# EAGLE design nxtcam_5 (EAGLE 6.4)
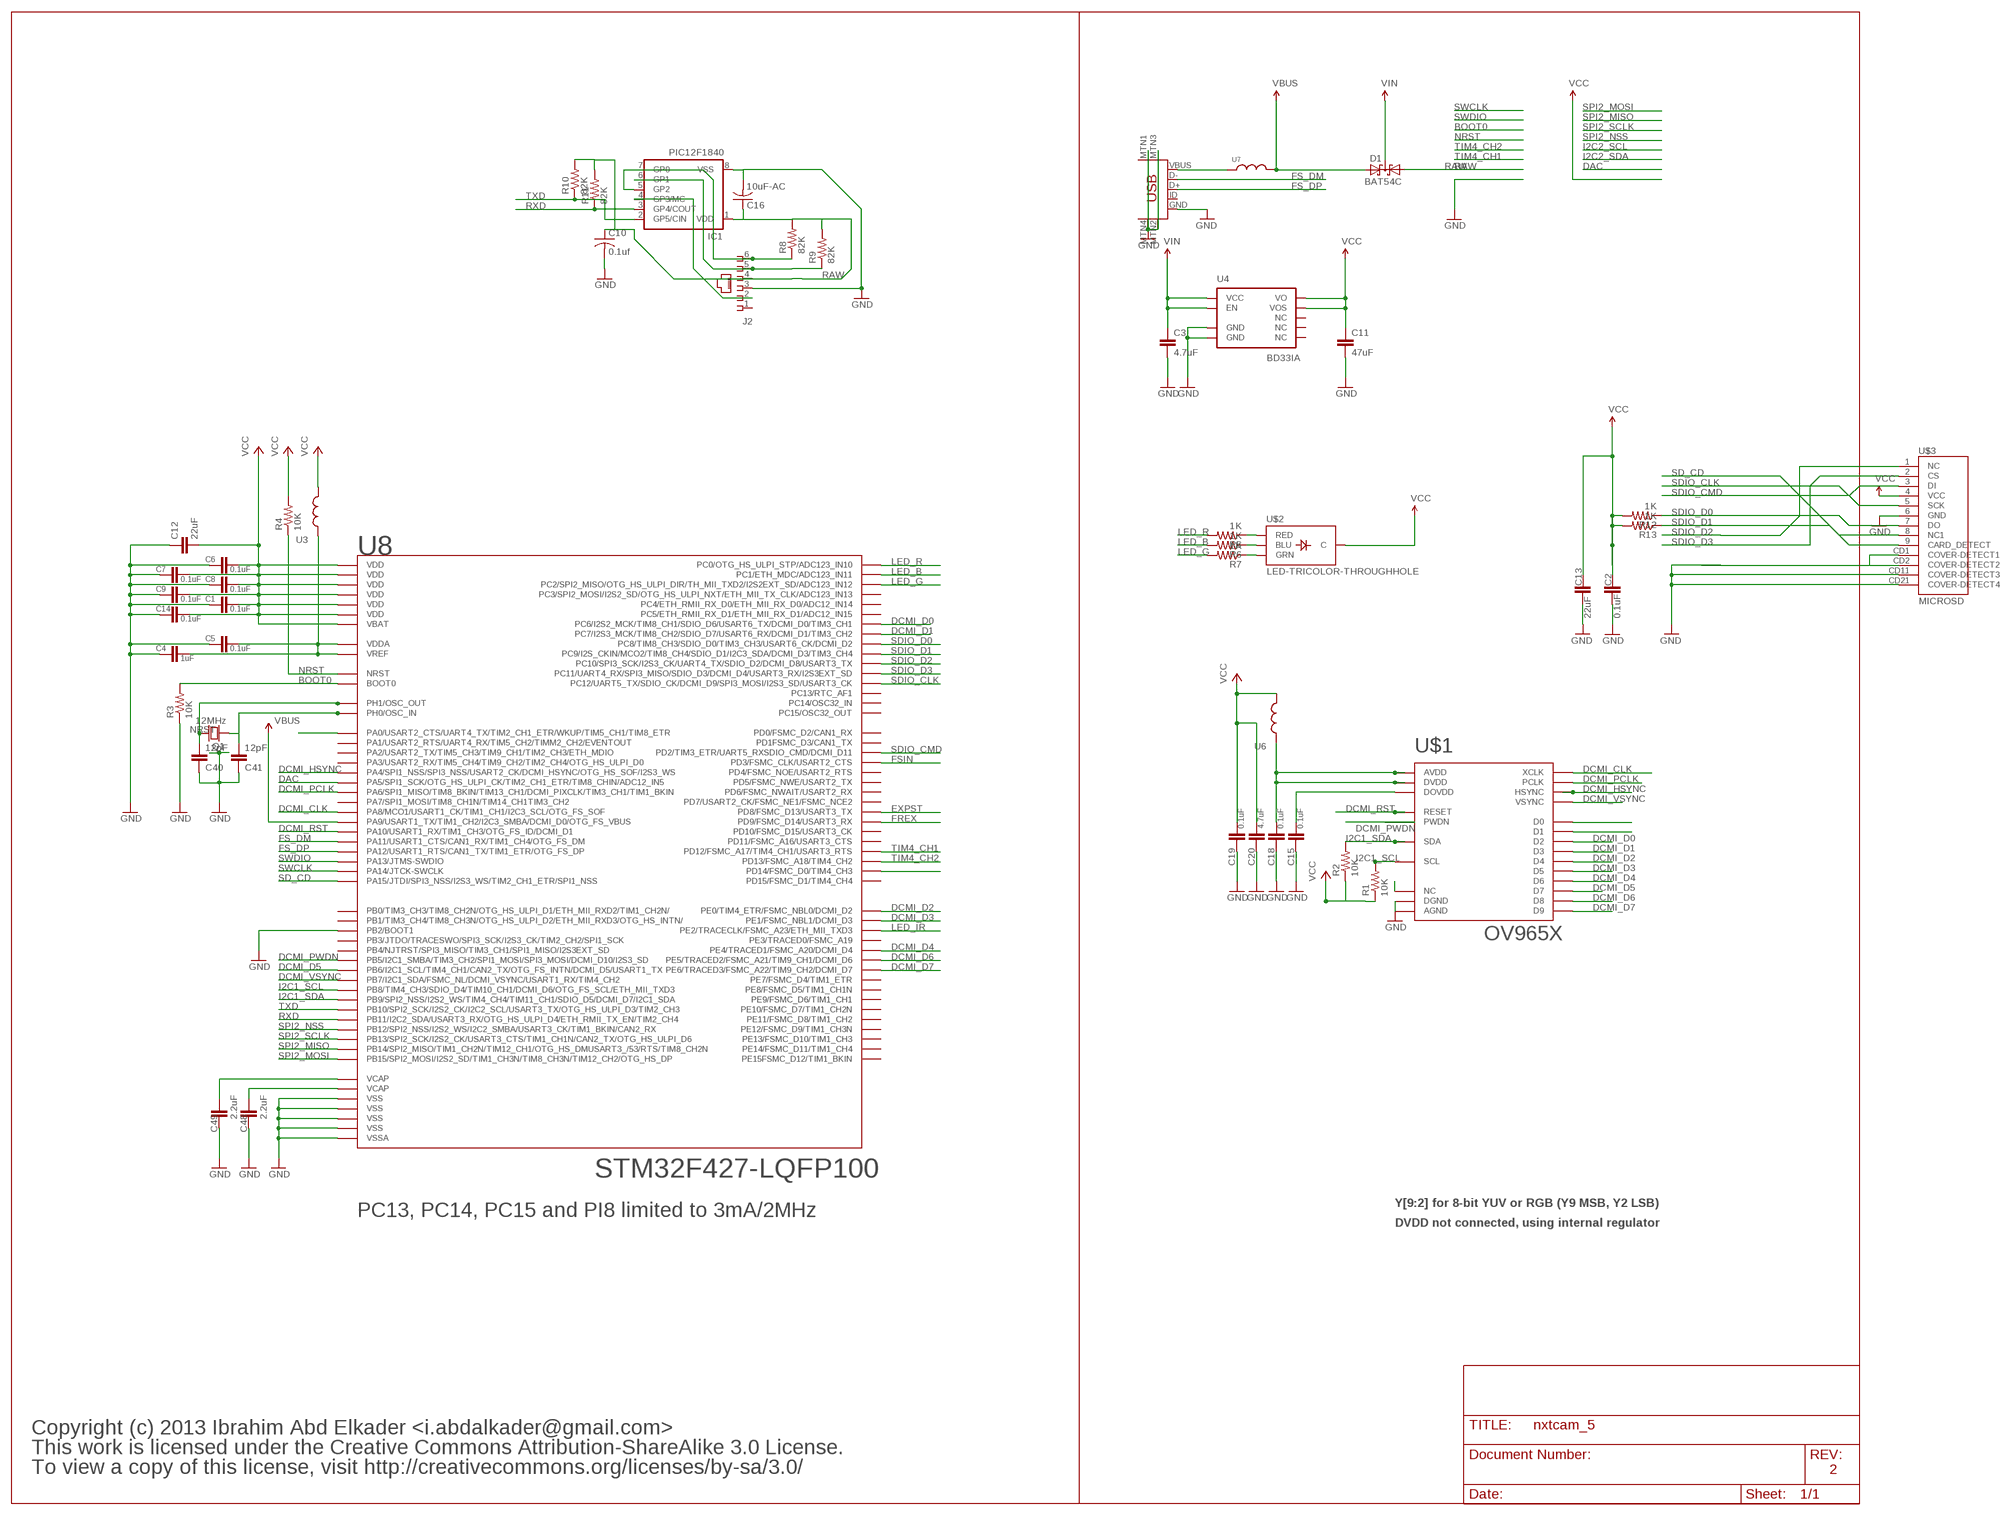
[diagram p0: schematic, sheet 1]

## Parts
C1  0.1uF  CAP0603-CAP  [0603-CAP]
C2  0.1uF  CAP0603-CAP  [0603-CAP]
C3  4.7uF  CAP0603-CAP  [0603-CAP]
C4  1uF  CAP0603-CAP  [0603-CAP]
C5  0.1uF  CAP0603-CAP  [0603-CAP]
C6  0.1uF  CAP0603-CAP  [0603-CAP]
C7  0.1uF  CAP0603-CAP  [0603-CAP]
C8  0.1uF  CAP0603-CAP  [0603-CAP]
C9  0.1uF  CAP0603-CAP  [0603-CAP]
C10  0.1uf  C-USC0603K  [C0603K]
C11  47uF  CAP1206  [1206]
C12  22uF  CAP0805  [0805]
C13  22uF  CAP0805  [0805]
C14  0.1uF  CAP0603-CAP  [0603-CAP]
C15  0.1uF  CAP0603-CAP  [0603-CAP]
C16  10uF-AC  C-USC1206K  [C1206K]
C18  0.1uF  CAP0603-CAP  [0603-CAP]
C19  0.1uF  CAP0603-CAP  [0603-CAP]
C20  4.7uF  CAP0603-CAP  [0603-CAP]
C40  12pF  CAP0603-CAP  [0603-CAP]
C41  12pF  CAP0603-CAP  [0603-CAP]
C48  2.2uF  CAP0603-CAP  [0603-CAP]
C49  2.2uF  CAP0603-CAP  [0603-CAP]
D1  BAT54C  [SOT23]
IC1  PIC12F1840  [SOIC08]
J2  NXTCONN0  [NXTCONN0]
Q1  12MHz  TXC-CRYSTAL50X32  [TXC-SMD-50X32]
R1  10K  RESISTOR0603-RES  [0603-RES]
R2  10K  RESISTOR0603-RES  [0603-RES]
R3  10K  RESISTOR0603-RES  [0603-RES]
R4  10K  RESISTOR0603-RES  [0603-RES]
R5  1K  RESISTOR0603-RES  [0603-RES]
R6  1K  RESISTOR0603-RES  [0603-RES]
R7  1K  RESISTOR0603-RES  [0603-RES]
R8  82K  R-US_R0603  [R0603]
R9  82K  R-US_R0603  [R0603]
R10  82K  R-US_R0603  [R0603]
R11  82K  R-US_R0603  [R0603]
R12  1K  RESISTOR0603-RES  [0603-RES]
R13  1K  RESISTOR0603-RES  [0603-RES]
U3  INDUCTOR0603  [0603]
U4  BD33IA  [HTSOP-J8]
U6  INDUCTOR0603  [0603]
U7  INDUCTOR0603  [0603]
U8  STM32F427-LQFP100  STM32F407LQFP100  [LQFP100]
U$1  OV965X  [OV965X]
U$2  LED-TRICOLOR-THROUGHHOLE  [LED_TRICOLOR_THROUGHHOLE_SM]
U$3  MICROSD  [MICROSD_CN]
U$4  USB-MINIBTH  [USB-MINIB-ALIGNPINS]

## Nets
BOOT0: R3.2 U8.94(BOOT0)
DAC: U8.30(PA5/SPI1_SCK/OTG_HS_ULPI_CK/TIM2_CH1_ETR/TIM8_CHIN/ADC12_IN5)
DCMI_CLK: U8.67(PA8/MCO1/USART1_CK/TIM1_CH1/I2C3_SCL/OTG_FS_SOF) U$1.P$13(XCLK)
DCMI_D0: U8.63(PC6/I2S2_MCK/TIM8_CH1/SDIO_D6/USART6_TX/DCMI_D0/TIM3_CH1) U$1.P$19(D2)
DCMI_D1: U8.64(PC7/I2S3_MCK/TIM8_CH2/SDIO_D7/USART6_RX/DCMI_D1/TIM3_CH2) U$1.P$21(D3)
DCMI_D2: U8.97(PE0/TIM4_ETR/FSMC_NBL0/DCMI_D2) U$1.P$22(D4)
DCMI_D3: U8.98(PE1/FSMC_NBL1/DCMI_D3) U$1.P$20(D5)
DCMI_D4: U8.3(PE4/TRACED1/FSMC_A20/DCMI_D4) U$1.P$18(D6)
DCMI_D5: U8.92(PB6/I2C1_SCL/TIM4_CH1/CAN2_TX/OTG_FS_INTN/DCMI_D5/USART1_TX) U$1.P$16(D7)
DCMI_D6: U8.4(PE5/TRACED2/FSMC_A21/TIM9_CH1/DCMI_D6) U$1.P$14(D8)
DCMI_D7: U8.5(PE6/TRACED3/FSMC_A22/TIM9_CH2/DCMI_D7) U$1.P$12(D9)
DCMI_HSYNC: U8.29(PA4/SPI1_NSS/SPI3_NSS/USART2_CK/DCMI_HSYNC/OTG_HS_SOF/I2S3_WS) U$1.P$9(HSYNC)
DCMI_PCLK: U8.31(PA6/SPI1_MISO/TIM8_BKIN/TIM13_CH1/DCMI_PIXCLK/TIM3_CH1/TIM1_BKIN) U$1.P$17(PCLK)
DCMI_PWDN: U8.91(PB5/I2C1_SMBA/TIM3_CH2/SPI1_MOSI/SPI3_MOSI/DCMI_D10/I2S3_SD) U$1.P$8(PWDN)
DCMI_RST: U8.69(PA10/USART1_RX/TIM1_CH3/OTG_FS_ID/DCMI_D1) U$1.P$6(RESET)
DCMI_VSYNC: U8.93(PB7/I2C1_SDA/FSMC_NL/DCMI_VSYNC/USART1_RX/TIM4_CH2) U$1.P$7(VSYNC)
EXPST: U8.55(PD8/FSMC_D13/USART3_TX)
FREX: U8.56(PD9/FSMC_D14/USART3_RX)
FS_DM: U8.70(PA11/USART1_CTS/CAN1_RX/TIM1_CH4/OTG_FS_DM) U$4.D-
FS_DP: U8.71(PA12/USART1_RTS/CAN1_TX/TIM1_ETR/OTG_FS_DP) U$4.D+
FSIN: U8.84(PD3/FSMC_CLK/USART2_CTS)
GND: C1.2 C2.2 C3.2 C4.2 C5.2 C6.2 C7.2 C8.2 C9.2 C10.2 C11.2 C12.1 C13.2 C14.2 C15.2 C16.2 C18.2 C19.2 C20.2 C40.1 C41.1 C48.2 C49.2 IC1.8(VSS) J2.3 R3.1 U4.3(GND) U4.P$1(GND) U8.10(VSS) U8.20(VSSA) U8.27(VSS) U8.37(PB2/BOOT1) U8.74(VSS) U8.99(VSS) U$1.P$2(AGND) U$1.P$15(DGND) U$3.6(GND) U$3.CD1(COVER-DETECT1) U$3.CD2(COVER-DETECT2) U$3.CD11(COVER-DETECT3) U$3.CD21(COVER-DETECT4) U$4.GND U$4.MTN1(MTN2) U$4.MTN2(MTN3) U$4.MTN3(MTN1) U$4.MTN4
I2C1_SCL: R1.2 U8.95(PB8/TIM4_CH3/SDIO_D4/TIM10_CH1/DCMI_D6/OTG_FS_SCL/ETH_MII_TXD3) U$1.P$5(SCL)
I2C1_SDA: R2.2 U8.96(PB9/SPI2_NSS/I2S2_WS/TIM4_CH4/TIM11_CH1/SDIO_D5/DCMI_D7/I2C1_SDA) U$1.P$3(SDA)
LED_B: R6.2 U8.16(PC1/ETH_MDC/ADC123_IN11)
LED_G: R7.2 U8.17(PC2/SPI2_MISO/OTG_HS_ULPI_DIR/TH_MII_TXD2/I2S2EXT_SD/ADC123_IN12)
LED_IR: U8.1(PE2/TRACECLK/FSMC_A23/ETH_MII_TXD3)
LED_R: R5.2 U8.15(PC0/OTG_HS_ULPI_STP/ADC123_IN10)
N$1: C40.2 Q1.P$2 U8.13(PH1/OSC_OUT)
N$2: U$1.P$1(NC)
N$3: IC1.5(GP2) IC1.7(GP0) J2.6 R8.1
N$4: C41.2 Q1.P$1 U8.12(PH0/OSC_IN)
N$5: U$1.P$24(D0)
N$6: U$1.P$23(D1)
N$7: U8.23(PA0/USART2_CTS/UART4_TX/TIM2_CH1_ETR/WKUP/TIM5_CH1/TIM8_ETR)
N$8: U8.61(PD14/FSMC_D0/TIM4_CH3)
N$10: IC1.6(GP1) J2.5 R9.1
N$11: IC1.4(GP3/MC) J2.2
N$12: C4.1 C5.1 U3.1 U8.21(VREF) U8.22(VDDA)
N$13: C18.1 U6.1 U$1.P$4(AVDD) U$1.P$10(DVDD)
N$14: R5.1 U$2.RED
N$15: U7.1 U$4.VBUS
N$16: R6.1 U$2.BLU
N$17: C15.1 U$1.P$11(DOVDD)
N$18: R7.1 U$2.GRN
NRST: R4.1 U8.14(NRST)
RAW: C10.1 C16.1 D1.1(A1) IC1.1(VDD) J2.4 R8.2 R9.2 R10.2 R11.2
RXD: IC1.3(GP4/COUT) R11.1 U8.48(PB11/I2C2_SDA/USART3_RX/OTG_HS_ULPI_D4/ETH_RMII_TX_EN/TIM2_CH4)
SD_CD: U8.77(PA15/JTDI/SPI3_NSS/I2S3_WS/TIM2_CH1_ETR/SPI1_NSS) U$3.9(CARD_DETECT)
SDIO_CLK: U8.80(PC12/UART5_TX/SDIO_CK/DCMI_D9/SPI3_MOSI/I2S3_SD/USART3_CK) U$3.5(SCK)
SDIO_CMD: U8.83(PD2/TIM3_ETR/UART5_RXSDIO_CMD/DCMI_D11) U$3.3(DI)
SDIO_D0: R12.1 U8.65(PC8/TIM8_CH3/SDIO_D0/TIM3_CH3/USART6_CK/DCMI_D2) U$3.7(DO)
SDIO_D1: R13.1 U8.66(PC9/I2S_CKIN/MCO2/TIM8_CH4/SDIO_D1/I2C3_SDA/DCMI_D3/TIM3_CH4) U$3.8(NC1)
SDIO_D2: U8.78(PC10/SPI3_SCK/I2S3_CK/UART4_TX/SDIO_D2/DCMI_D8/USART3_TX) U$3.1(NC)
SDIO_D3: U8.79(PC11/UART4_RX/SPI3_MISO/SDIO_D3/DCMI_D4/USART3_RX/I2S3EXT_SD) U$3.2(CS)
SPI2_MISO: U8.53(PB14/SPI2_MISO/TIM1_CH2N/TIM12_CH1/OTG_HS_DMUSART3_/53/RTS/TIM8_CH2N)
SPI2_MOSI: U8.54(PB15/SPI2_MOSI/I2S2_SD/TIM1_CH3N/TIM8_CH3N/TIM12_CH2/OTG_HS_DP)
SPI2_NSS: U8.51(PB12/SPI2_NSS/I2S2_WS/I2C2_SMBA/USART3_CK/TIM1_BKIN/CAN2_RX)
SPI2_SCLK: U8.52(PB13/SPI2_SCK/I2S2_CK/USART3_CTS/TIM1_CH1N/CAN2_TX/OTG_HS_ULPI_D6)
SWCLK: U8.76(PA14/JTCK-SWCLK)
SWDIO: U8.72(PA13/JTMS-SWDIO)
TIM4_CH1: U8.59(PD12/FSMC_A17/TIM4_CH1/USART3_RTS)
TIM4_CH2: U8.60(PD13/FSMC_A18/TIM4_CH2)
TXD: IC1.2(GP5/CIN) R10.1 U8.47(PB10/SPI2_SCK/I2S2_CK/I2C2_SCL/USART3_TX/OTG_HS_ULPI_D3/TIM2_CH3)
VBUS: D1.2(A2) U7.2 U8.68(PA9/USART1_TX/TIM1_CH2/I2C3_SMBA/DCMI_D0/OTG_FS_VBUS)
VCAP1: C49.1 U8.49(VCAP)
VCAP2: C48.1 U8.73(VCAP)
VCC: C1.1 C2.1 C6.1 C7.1 C8.1 C9.1 C11.1 C12.2 C13.1 C14.1 C19.1 C20.1 R1.1 R2.1 R4.2 R12.2 R13.2 U3.2 U4.1(VO) U4.2(VOS) U6.2 U8.6(VBAT) U8.11(VDD) U8.19(VDD) U8.28(VDD) U8.50(VDD) U8.75(VDD) U8.100(VDD) U$2.GND(C) U$3.4(VCC)
VIN: C3.1 D1.3(CC) U4.5(EN) U4.8(VCC)
Unconnected: J2.1 U4.4(NC) U4.6(NC) U4.7(NC) U8.2(PE3/TRACED0/FSMC_A19) U8.7(PC13/RTC_AF1) U8.8(PC14/OSC32_IN) U8.9(PC15/OSC32_OUT) U8.18(PC3/SPI2_MOSI/I2S2_SD/OTG_HS_ULPI_NXT/ETH_MII_TX_CLK/ADC123_IN13) U8.24(PA1/USART2_RTS/UART4_RX/TIM5_CH2/TIMM2_CH2/EVENTOUT) U8.25(PA2/USART2_TX/TIM5_CH3/TIM9_CH1/TIM2_CH3/ETH_MDIO) U8.26(PA3/USART2_RX/TIM5_CH4/TIM9_CH2/TIM2_CH4/OTG_HS_ULPI_D0) U8.32(PA7/SPI1_MOSI/TIM8_CH1N/TIM14_CH1TIM3_CH2) U8.33(PC4/ETH_RMII_RX_D0/ETH_MII_RX_D0/ADC12_IN14) U8.34(PC5/ETH_RMII_RX_D1/ETH_MII_RX_D1/ADC12_IN15) U8.35(PB0/TIM3_CH3/TIM8_CH2N/OTG_HS_ULPI_D1/ETH_MII_RXD2/TIM1_CH2N/) U8.36(PB1/TIM3_CH4/TIM8_CH3N/OTG_HS_ULPI_D2/ETH_MII_RXD3/OTG_HS_INTN/) U8.38(PE7/FSMC_D4/TIM1_ETR) U8.39(PE8/FSMC_D5/TIM1_CH1N) U8.40(PE9/FSMC_D6/TIM1_CH1) U8.41(PE10/FSMC_D7/TIM1_CH2N) U8.42(PE11/FSMC_D8/TIM1_CH2) U8.43(PE12/FSMC_D9/TIM1_CH3N) U8.44(PE13/FSMC_D10/TIM1_CH3) U8.45(PE14/FSMC_D11/TIM1_CH4) U8.46(PE15FSMC_D12/TIM1_BKIN) U8.57(PD10/FSMC_D15/USART3_CK) U8.58(PD11/FSMC_A16/USART3_CTS) U8.62(PD15/FSMC_D1/TIM4_CH4) U8.81(PD0/FSMC_D2/CAN1_RX) U8.82(PD1FSMC_D3/CAN1_TX) U8.85(PD4/FSMC_NOE/USART2_RTS) U8.86(PD5/FSMC_NWE/USART2_TX) U8.87(PD6/FSMC_NWAIT/USART2_RX) U8.88(PD7/USART2_CK/FSMC_NE1/FSMC_NCE2) U8.89(PB3/JTDO/TRACESWO/SPI3_SCK/I2S3_CK/TIM2_CH2/SPI1_SCK) U8.90(PB4/NJTRST/SPI3_MISO/TIM3_CH1/SPI1_MISO/I2S3EXT_SD) U$4.ID

## Notes on the sheet
- Y[9:2] for 8-bit YUV or RGB (Y9 MSB, Y2 LSB)
- PC13, PC14, PC15 and PI8 limited to 3mA/2MHz
- DVDD not connected, using internal regulator
- Copyright (c) 2013 Ibrahim Abd Elkader <i.abdalkader@gmail.com>
- This work is licensed under the Creative Commons Attribution-ShareAlike 3.0 License.
- To view a copy of this license, visit http://creativecommons.org/licenses/by-sa/3.0/ | 2

## Library data of the parts
C1-C9 C11-C15 C18-C20 C40 C41 C48 C49 = sfe:CAP: Capacitor Standard 0603 ceramic capacitor, and 0.1" leaded capacitor.
C10 = wbyb:C-US: CAPACITOR, American symbol
C16 = rcl:C-US: CAPACITOR, American symbol
D1 = diode:BAT54C: Schottky Diodes Source: Fairchild .. BAT54.pdf
IC1 = robotics:PIC12*: MICROCONTROLLER
J2 = robotics:NXTCONN: AMP connector
Q1 = pyboard:TXC-CRYSTAL
R1-R7 R12 R13 = SparkFun:RESISTOR: Resistor Basic schematic elements and footprints for 0603, 1206, and PTH resistors.
R8-R11 = rcl:R-US_: RESISTOR, American symbol
U3 U6 U7 = sfe:INDUCTOR: Inductors Basic Inductor/Choke - 0603 and 1206. Footprints are not proven and vary greatly between part numbers.
U4 = mux:BD33IA
U8 = mux:STM32F407
U$1 = OV965x:OV965X
U$2 = SparkFun:LED-TRICOLOR-THROUGHHOLE
U$3 = SparkFun:MICROSD
U$4 = SparkFun:USB-MINIB: Mini-USB "B" connector with 5th pin broken out. Created new symbol breaking out 5th "ID" pin in mini/micro USB connector spec. See: http://en.wikipedia.org/wiki/Mini_usb#Cables. Uses same footprint as 4-pin symbol. Also added pins to connect to mounting / shield pads if required (probably not generally needed as signals aren't shielded once they leave the connector).

## Board
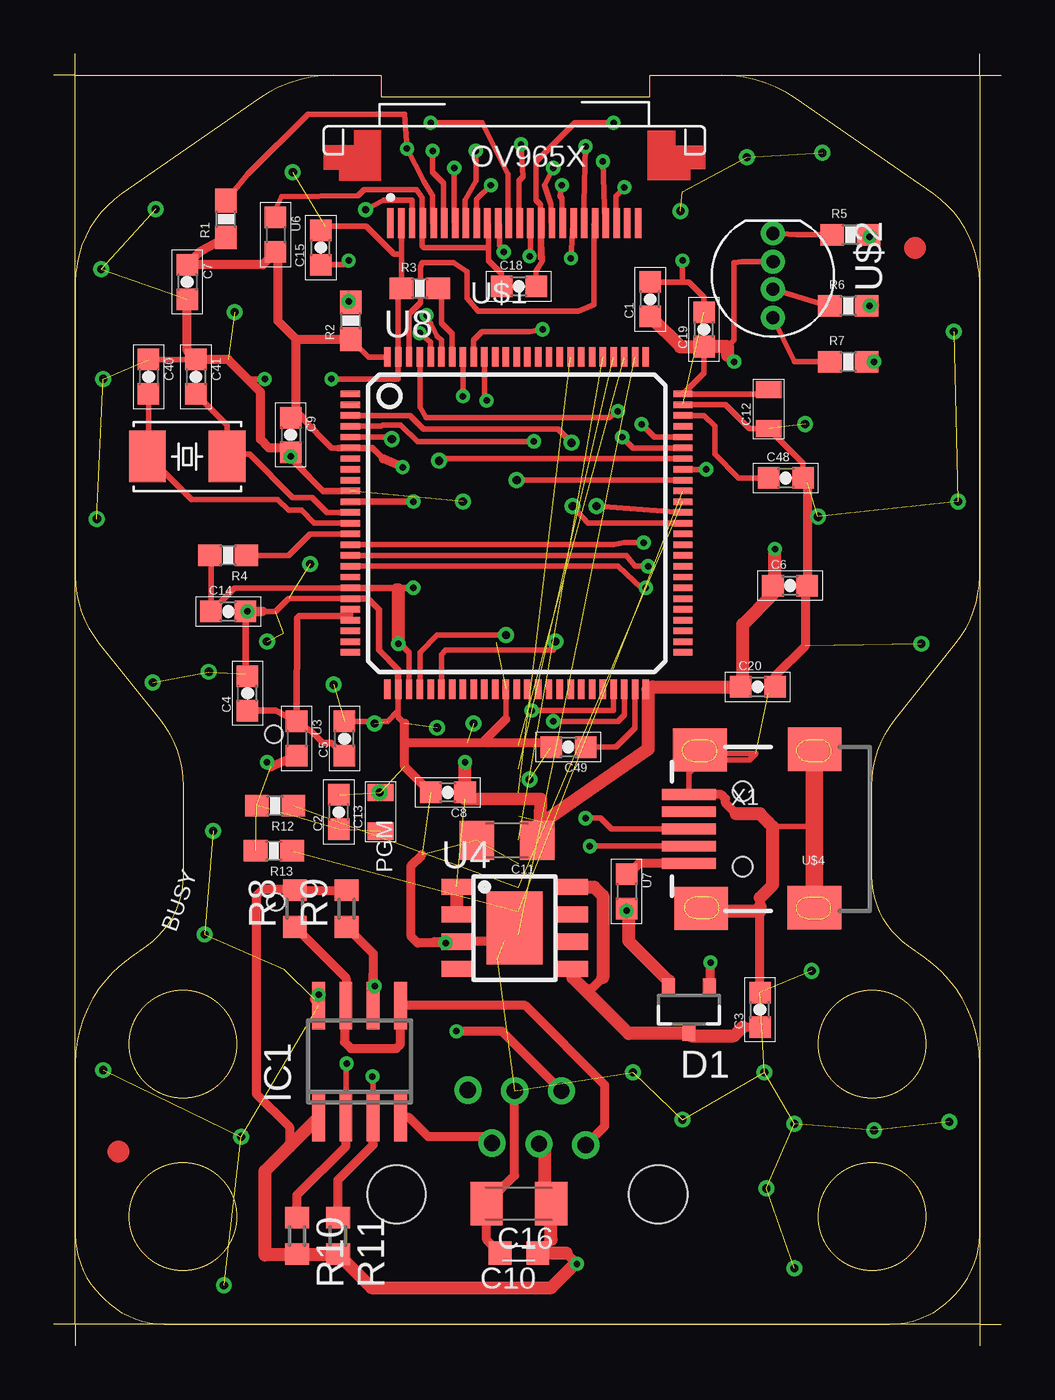
[diagram p1: board, top side]
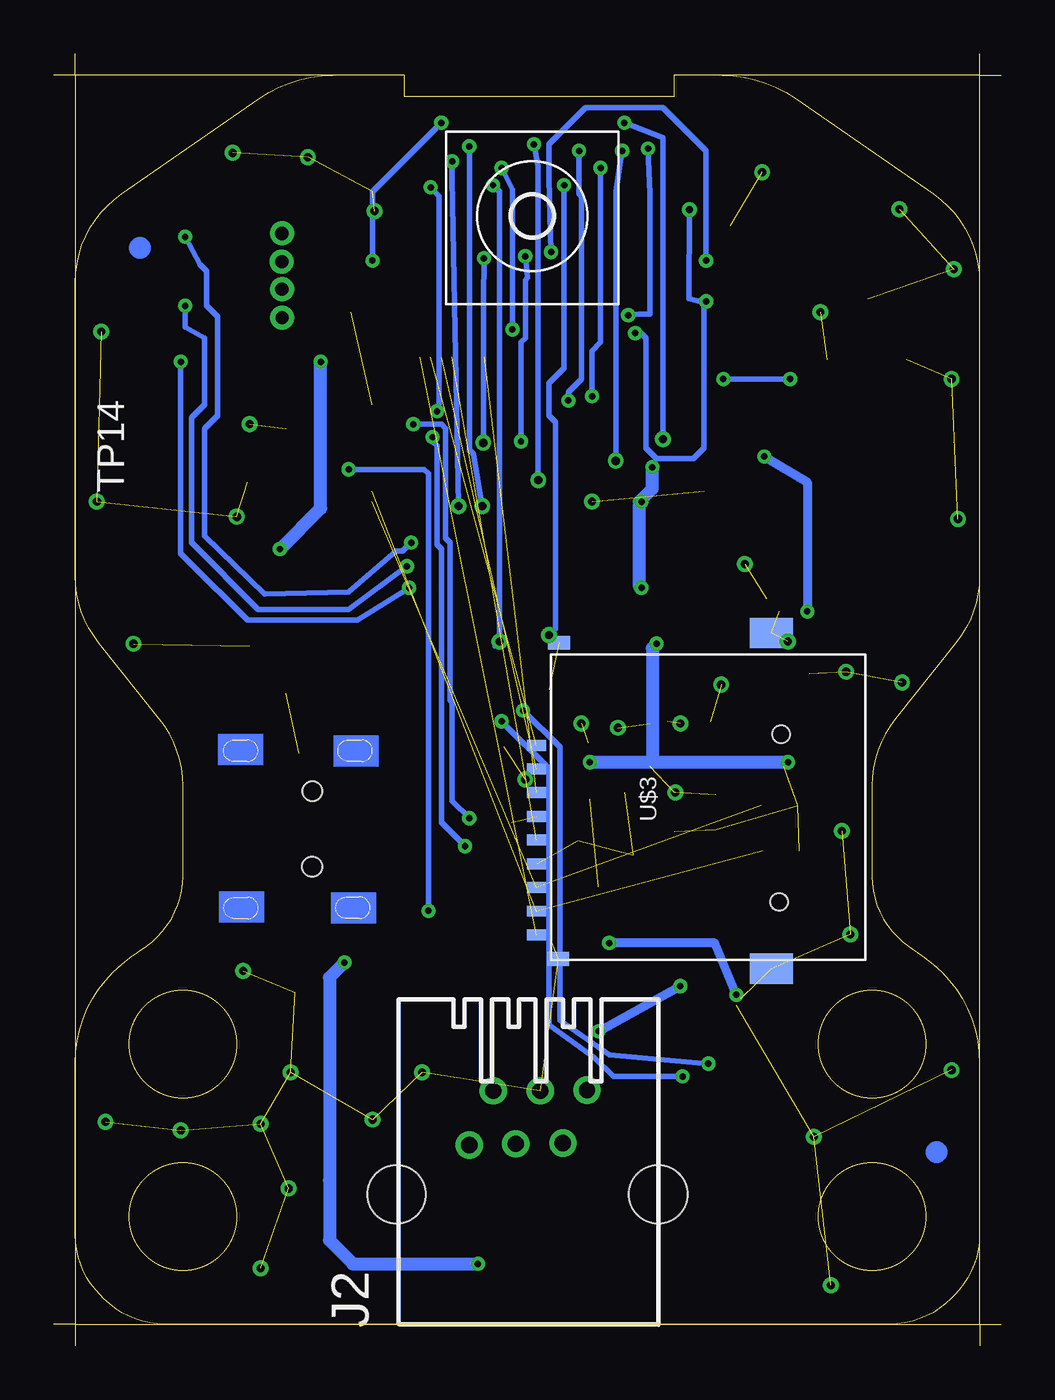
[diagram p2: board, bottom side, seen from below]

Size 44 x 60 mm. Coordinates in mm from the lower left corner, seen from the top.
Outline: 1,59 15.2,59 15.2,58 27.7,58 27.7,59 43,59
Outline: 43,59 43,1
Outline: 43,1 1,1
Outline: 1,1 1,59
Outline: 1,59 1,60
Outline: 1,59 0,59
Outline: 43,59 44,59
Outline: 43,59 43,60
Outline: 43,1 43,0
Outline: 43,1 44,1
Outline: 1,1 0,1
Outline: 1,1 1,0
Outline: 2.33,2.17 arc45 5.16,1 38.84,1 arc45 41.67,2.17
Outline: 41.83,2.33 arc45 43,5.16 43,13.12 arc55 40.44,18.03 39.71,18.55 arc-55 38,21.83 38,26 arc-39 39.1,29.12 41.91,32.63 arc39 43,35.76 43,49.38 arc55 40.85,53.49 34.45,57.93 arc35 31.03,59
Outline: 12.97,59 arc35 9.55,57.93 3.15,53.49 arc55 1,49.38 1,35.76 arc39 2.09,32.63 4.91,29.12 arc-39 6,26 6,21.83 arc-55 4.29,18.55 3.56,18.03 arc55 1,13.12 1,5.16 arc45 2.17,2.33
Outline: circle at 38,6 radius 2.5
Outline: circle at 6,6 radius 2.5
Outline: circle at 38,14 radius 2.5
Outline: circle at 6,14 radius 2.5
Copper layers (1*16): Top 0.035mm / dielectric 1.5mm / Bottom 0.035mm
Design rules "6mils": minimum track width 10mil, minimum drill 15mil, track to track 6mil, track to pad 6mil, pad to pad 6mil, via to via 6mil, smd to smd 6mil, copper to edge 19mil, drill to drill 10mil, minimum pad ring 10mil, minimum via ring 7mil, stop-mask expansion 0mil, vias tented up to drill 0mil, thermal gap 10mil
Milling: 28 lines

### Footprints (pad centres in the part's own frame; a part is rotated, then mirrored left to right if it is on the bottom)
0603-CAP = smd 1 x 1: 1 -0.8,0; 2 0.8,0
C0603K = smd 1.05 x 1.08: 1 -0.875,0; 2 0.875,0
1206 = smd 1.6 x 1.8: 1 -1.4,0; 2 1.4,0
0805 = smd 0.8 x 1.2: 1 -0.9,0; 2 0.9,0
C1206K = smd 1.5 x 2: 1 -1.5,0; 2 1.5,0
SOT23 = smd 0.6 x 0.7: 1 -0.95,-1.1; 2 0.95,-1.1; 3 0,1.1
SOIC08 = smd 0.6 x 2.2: 1 -1.905,-2.6; 2 -0.635,-2.6; 3 0.635,-2.6; 4 1.905,-2.6; 5 1.905,2.6; 6 0.635,2.6; 7 -0.635,2.6; 8 -1.905,2.6
NXTCONN0 = drill 0.76: 1 2.764,5.57; 2 1.647,3.102; 3 0.59,5.535; 4 -0.539,3.076; 5 -1.584,5.534; 6 -2.705,3.01 | hole 2.7: -6.08,0.73; 6.08,0.73
TXC-SMD-50X32 = smd 1.7 x 2.4: P$1 -1.85,0; P$2 1.85,0
0603-RES = smd 1.1 x 1: 1 -0.85,0; 2 0.85,0
R0603 = smd 1 x 1.1: 1 -0.85,0; 2 0.85,0
0603 = smd 1 x 1: 1 -0.8,0; 2 0.8,0
HTSOP-J8 = smd 0.75 x 1.4: 1 -1.905,-2.7; 2 -0.635,-2.7; 3 0.635,-2.7; 4 1.905,-2.7; 5 1.905,2.7; 6 0.635,2.7; 7 -0.635,2.7; 8 -1.905,2.7 | smd 3.4 x 2.6: P$1 0,0
LQFP100 = smd 0.9 x 0.3: 1 -7.72,6; 2 -7.72,5.5; 3 -7.72,5; 4 -7.72,4.5; 5 -7.72,4; 6 -7.72,3.5; 7 -7.72,3; 8 -7.72,2.5; 9 -7.72,2; 10 -7.72,1.5; 11 -7.72,1; 12 -7.72,0.5; 13 -7.72,0; 14 -7.72,-0.5; 15 -7.72,-1; 16 -7.72,-1.5; 17 -7.72,-2; 18 -7.72,-2.5; 19 -7.72,-3; 20 -7.72,-3.5; 21 -7.72,-4; 22 -7.72,-4.5; 23 -7.72,-5; 24 -7.72,-5.5; 25 -7.72,-6; 51 7.72,-6; 52 7.72,-5.5; 53 7.72,-5; 54 7.72,-4.5; 55 7.72,-4; 56 7.72,-3.5; 57 7.72,-3; 58 7.72,-2.5; 59 7.72,-2; 60 7.72,-1.5; 61 7.72,-1; 62 7.72,-0.5; 63 7.72,0; 64 7.72,0.5; 65 7.72,1; 66 7.72,1.5; 67 7.72,2; 68 7.72,2.5; 69 7.72,3; 70 7.72,3.5; 71 7.72,4; 72 7.72,4.5; 73 7.72,5; 74 7.72,5.5; 75 7.72,6 | smd 0.3 x 0.9: 26 -6,-7.72; 27 -5.5,-7.72; 28 -5,-7.72; 29 -4.5,-7.72; 30 -4,-7.72; 31 -3.5,-7.72; 32 -3,-7.72; 33 -2.5,-7.72; 34 -2,-7.72; 35 -1.5,-7.72; 36 -1,-7.72; 37 -0.5,-7.72; 38 0,-7.72; 39 0.5,-7.72; 40 1,-7.72; 41 1.5,-7.72; 42 2,-7.72; 43 2.5,-7.72; 44 3,-7.72; 45 3.5,-7.72; 46 4,-7.72; 47 4.5,-7.72; 48 5,-7.72; 49 5.5,-7.72; 50 6,-7.72; 76 6,7.72; 77 5.5,7.72; 78 5,7.72; 79 4.5,7.72; 80 4,7.72; 81 3.5,7.72; 82 3,7.72; 83 2.5,7.72; 84 2,7.72; 85 1.5,7.72; 86 1,7.72; 87 0.5,7.72; 88 0,7.72; 89 -0.5,7.72; 90 -1,7.72; 91 -1.5,7.72; 92 -2,7.72; 93 -2.5,7.72; 94 -3,7.72; 95 -3.5,7.72; 96 -4,7.72; 97 -4.5,7.72; 98 -5,7.72; 99 -5.5,7.72; 100 -6,7.72
OV965X = smd 0.3 x 1.4: P$1 -6.235,-0.07; P$2 -5.735,-0.07; P$3 -5.235,-0.07; P$4 -4.735,-0.07; P$5 -4.235,-0.07; P$6 -3.735,-0.07; P$7 -3.235,-0.07; P$8 -2.735,-0.07; P$9 -2.235,-0.07; P$10 -1.735,-0.07; P$11 -1.235,-0.07; P$12 -0.735,-0.07; P$13 -0.235,-0.07; P$14 0.265,-0.07; P$15 0.765,-0.07; P$16 1.265,-0.07; P$17 1.765,-0.07; P$18 2.265,-0.07; P$19 2.765,-0.07; P$20 3.265,-0.07; P$21 3.765,-0.07; P$22 4.265,-0.07; P$23 4.765,-0.07; P$24 5.265,-0.07
LED_TRICOLOR_THROUGHHOLE_SM = drill 0.61 pad 0.965: BLU 0.638,0.005; GND -0.641,0.01; GRN 1.95,0; RED -1.961,0.005
MICROSD_CN = smd 0.508 x 0.889: 1 3.555,8.351; 2 2.458,8.351; 3 1.357,8.354; 4 0.259,8.35; 5 -0.845,8.354; 6 -1.943,8.352; 7 -3.039,8.35; 8 -4.147,8.357; 9 -5.242,8.353 | smd 0.635 x 1.016: CD1 -6.366,7.354; CD11 8.322,7.302 | smd 1.4 x 2: CD2 -6.816,-2.565; CD21 8.772,-2.564 | hole 0.8: -3.718,-2.922; 4.068,-3.005
USB-MINIB-ALIGNPINS = smd 2.5 x 0.5: D+ 2.5,0; D- 2.5,0.8; GND 2.5,-1.6; ID 2.5,-0.8; VBUS 2.5,1.6 | smd 2.5 x 2: MTN1 -3.322,3.656; MTN2 1.93,3.687; MTN3 -3.339,-3.702; MTN4 1.981,-3.67 | hole 0.9: -0.003,1.75; -0.002,-1.75

### Placement (x,y rotation side)
C1  27.7,48.6 90 top
C2  13.24,24.79 90 top
C3  32.8,15.6 90 top
C4  9,30.3 90 top
C5  13.5,28.2 90 top
C6  34.2,35.3 0 top
C7  6.2,49.4 270 top
C8  18.3,25.7 180 top
C9  11,42.3 270 top
C10  21.6,4.3 180 top
C11  21.05,23.47 180 top
C12  33.2,43.5 90 top
C13  15.17,24.79 90 top
C14  8.1,34.1 0 top
C15  12.4,51 90 top
C16  21.6,6.6 180 top
C18  21.6,49.2 0 top
C19  30.2,47.2 90 top
C20  32.7,30.6 0 top
C40  4.4,45 270 top
C41  6.6,45 270 top
C48  34,40.3 0 top
C49  23.9,27.8 180 top
D1  29.5,15.6 180 top
GFID1  Gfid1  [VISION_REF10]  40.01,50.99 180 top
GFID2  Gfid1  [VISION_REF10]  3,9 180 top
GFID3  Gfid1  [VISION_REF10]  2.99,8.99 180 bottom
GFID4  Gfid1  [VISION_REF10]  39.99,50.99 180 bottom
IC1  14.2,13.2 0 top
J2  22,6.3 0 bottom
Q1  6.2,41.3 180 top
R1  8,52.33 90 top
R2  13.8,47.6 90 top
R3  17,49.1 0 top
R4  8.1,36.7 180 top
R5  37,51.6 0 top
R6  36.9,48.3 0 top
R7  36.9,45.7 0 top
R8  11.2,20.3 90 top
R9  13.6,20.3 90 top
R10  11.3,5.1 270 top
R11  13.2,5.1 270 top
R12  10.28,25.08 180 top
R13  10.22,22.99 180 top
U3  11.28,28.2 270 top
U4  21.4,19.4 270 top
U6  10.3,51.6 270 top
U7  26.6,21.1 270 top
U8  21.5,38.2 0 top
U$1  21.87,52.2 0 top
U$2  33.4,49.7 270 top
U$3  13.23,24.33 90 bottom
U$4  32,24 180 top

### Tracks (layer width: path | path; a pad name or v marks a point on that pad's centre or on a via)
BOOT0
  Top 0.254: R3.2 18,49.1 18,47.5 18.3,47.2 18.5,47 U8.94
DCMI_CLK  (via drill 0.3, 0.38)
  Top 0.254: U$1.P$13 21.6,52.17 21.6,54.1 21.8,54.3 v21.7,55.8 | v21.5,40.2 U8.67
  Bottom 0.254: v21.7,55.8 21.5,54.8 v21.5,40.2
DCMI_D0  (via drill 0.3, 0.38)
  Top 0.254: U$1.P$19 24.6,52.17 v24.7,55.7 | v24.1,39 24.8,38.2 26,38.2 U8.63
  Bottom 0.254: v24.7,55.7 24.7,41.6 24.5,41.4 v24.1,39
DCMI_D1  (via drill 0.3, 0.38)
  Top 0.254: U$1.P$21 25.68,52.09 25.6,52.17 v25.5,55 | v25.2,39 U8.64
  Bottom 0.254: v25.5,55 25.5,54.2 v25.2,39
DCMI_D2  (via drill 0.3)
  Top 0.254: U$1.P$22 26.1,52.17 26.1,53.4 v26.5,53.8 | v26.2,43.4 25.8,43.1 17.3,43.1 17.01,43.6 U8.97
  Bottom 0.254: v26.5,53.8 26.1,53.4 26.1,44.5 26.1,43.4 v26.2,43.4
DCMI_D3
  Top 0.254: U$1.P$20 25.08,52.07 25.08,48.35 24.38,48.05 19.71,48.05 19.2,48.66 19.2,49.88 18.58,50.3 17.11,50.3 17.03,50.09 17.03,48.44 16.5,47.91 U8.98
DCMI_D4  (via drill 0.3, 0.38)
  Top 0.254: U$1.P$18 24.12,52.11 v24.02,50.51 | v24.05,41.94 23.41,42.57 17.17,42.57 16.54,43.2 U8.3
  Bottom 0.254: v24.02,50.51 24.05,48.54 v24.05,41.94
DCMI_D5  (via drill 0.3)
  Top 0.254: U$1.P$16 23.1,52.17 23.1,53 22.8,53.9 v23.2,54.7 | v22.7,47.2 22.1,47.1 19.9,47.1 19.5,46.7 U8.92
  Bottom 0.254: v23.2,54.7 22.7,53.7 22.7,47.7 v22.7,47.2
DCMI_D6  (via drill 0.3)
  Top 0.254: U8.4 14.7,42.7 15.2,42.7 15.3,42.75 16.1,42.75 16.9,42 v22.3,42 | v22.1,50.6 22.14,50.84 U$1.P$14
  Bottom 0.254: v22.3,42 22.3,46.4 22.3,46.6 22.1,46.8 22.1,49.5 22,49.6 v22.1,50.6
DCMI_D7  (via drill 0.3, 0.38)
  Top 0.254: U$1.P$12 21.1,52.17 21.1,53.8 21.1,54.4 19.9,56.8 v17.5,56.8 | v15.7,42.1 15.6,42.2 U8.5
  Bottom 0.254: v17.5,56.8 15.7,56.1 v15.7,42.1
DCMI_HSYNC  (via drill 0.3, 0.38)
  Top 0.254: U8.29 17,32.2 17.8,33 v21,33 | v20.3,53.9 19.64,53.24 U$1.P$9
  Bottom 0.254: v21,33 20.7,33.3 20.7,41.5 20.7,42.9 21,43.2 21,44.7 20.3,45.4 v20.3,53.9
DCMI_PCLK  (via drill 0.3, 0.38)
  Top 0.254: U$1.P$17 23.6,52.17 23.6,53.3 23.5,53.4 v23.6,53.9 | v23.3,32.7 23.2,32.3 18.2,32.3 18,32.1 U8.31
  Bottom 0.254: v23.6,53.9 23.3,53.6 23.3,52.7 v23.3,32.7 | v23.3,32.7 23.5,32.5 v23.3,32.7
DCMI_PWDN  (via drill 0.3)
  Top 0.254: U$1.P$8 19.1,52.17 19.1,53.2 19.6,54.1 v19.6,55.5 | v20.1,43.9 20,44 U8.91
  Bottom 0.254: v19.6,55.5 19.6,53.5 19.5,53.4 19.5,44.9 20.1,44.3 v20.1,43.9
DCMI_RST  (via drill 0.3, 0.38)
  Top 0.254: U$1.P$6 18.1,52.17 18.1,54 17.6,54.5 v17.6,55.5 | v17.9,41.1 18,41.2 U8.69
  Bottom 0.254: v17.6,55.5 17.9,53.6 17.9,44.9 v17.9,41.1
DCMI_VSYNC  (via drill 0.3)
  Top 0.254: U$1.P$7 18.6,52.17 v18.6,54.7 | v19,44.1 U8.93
  Bottom 0.254: v18.6,54.7 18.6,46.6 19,46.2 v19,44.1
FS_DM  (via drill 0.3)
  Top 0.254: U$4.D- 27,23.2 v24.9,23.2 | v26.4,42.2 26.9,41.7 U8.70
  Bottom 0.254: v24.9,23.2 26,24.3 26,37 26.2,37.2 26.2,40.5 26.2,41.8 26.4,42 v26.4,42.2
FS_DP  (via drill 0.3)
  Top 0.254: U$4.D+ 25.9,24 25.4,24.5 v24.7,24.5 | v27.3,42.8 27.9,42.2 U8.71
  Bottom 0.254: v24.7,24.5 25.5,25.3 25.5,29.9 25.6,30 25.6,37.3 25.8,37.5 25.8,41.2 25.8,42.6 26,42.8 v27.3,42.8
GND  (via drill 0.3, 0.38)  (52 unrouted)
  Top 0.254: U$1.P$2 16.15,50.7 | 16.15,50.7 R3.1 16,49.1 U8.99 16,44.9 v12.9,44.9 | U$1.P$15 22.6,52.09 22.7,50.4 | 22.7,50.4 22.4,49.9 C18.2 | C40.1 C41.1 | U8.10 12.5,39.7 11,41.2 C9.2 | U8.20 10.9,34.7 10.3,34.1 C14.2 | C5.2 15.5,29 16,29.5 U8.27 16,29.2 16.3,28.9 | U8.74 31.2,43.7 32.3,42.6 C12.1 34.8,41 C48.2 | C1.2 29.2,49.4 | 29.2,49.4 29.5,49.4 30.2,48.7 C19.2 | U8.37 21,29.1 | C15.2 12.6,52 14.5,52 15.8,50.7 16.15,50.7 | v9.8,44.9 9,44.9 | 22.7,50.4 22.6,50.5 22.6,53 22.4,53.2 22.4,55 24.2,56.8 v26,56.8 | v29.2,50.4 29.2,49.4 | U$4.MTN2 30.18,20.2 | U$4.MTN1 35.27,20.4 | U$4.MTN4 30.19,27.5 32.6,27.5 32.3,27.2 29.7,27.2 29.7,26.8 29.5,26.6 U$4.GND | 35.32,24.11 35.04,24.11 33.64,24.11 33.4,24.1
  Top 0.305: C4.2 8.9,31.2 C14.2 | U8.27 16,31.4 15.1,32.3 15.1,34.2 14.6,34.7 U8.20 | U8.10 12.5,39.7 12,40.2 v11,41.3
  Top 0.406: C3.2 32.8,20.2 | 32.8,20.4 32.8,20.8 | 33.4,24.1 33.2,24.3 | 31.7,24.7 31.2,25.2 31.2,25.4 31,25.6 U$4.GND | U4.3 18.73,18.8 | 18.73,18.8 20.9,18.8 21.4,19.3 U4.P$1 | J2.3 21.41,7.91 C16.2 20.1,4.92 C10.2 | C9.2 10.8,41.7 10,41.7 9.6,42.1 9.6,44.3 9,44.9 8.1,45.8 C41.1 6.2,46.2 C7.2 | 18.73,18.8 U4.3 | U4.3 18.64,18.7 v18.2,18.7 | v18.2,18.7 16.9,18.7 16.6,19 16.6,22.3 17.1,22.8 | C48.2 35,40.1 C6.2 34.9,35.2 34.9,32.5 33.5,31.1 C20.2 33.2,30.3 | C8.2 16.3,26.9 16.3,28 | 16.3,28 16.3,28.9 | v9,34.1 9.7,34.1 C14.2 | IC1.8 12.1,16.09 v12.3,16.3 | v18.2,18.7 17.66,18.77 U4.3 | C49.2 22.9,28 19.2,28 | 19.2,28 16.3,28 | 21,29.1 19.9,28 19.2,28
  Top 0.61: 32.8,20.8 33.4,21.4 33.4,24.1 | 33.2,24.3 32.8,24.7 31.7,24.7 | 30.18,20.2 32.8,20.2 32.8,20.4
  Top 0.813: U$4.MTN3 35.32,27.68 35.32,24.11 U$4.MTN1
  Bottom 0.254: v12.9,44.9 v9.8,44.9 | v26,56.8 29.2,53.6 v29.2,50.4
  Bottom 0.406: v11,41.3 9,40.1 v9,34.1 | v12.3,16.3 13.3,18.7 v18.2,18.7
  other vias: 2.2,50 2.3,44.9 2,38.4 4.6,30.8 7.4,23.9 11.1,54.5 32.2,55.2 35.7,55.4 4.73,52.78 41.8,47.1 42,39.2 40.3,32.6 35.2,17.4 41.6,10.4 34.4,10.3 34.4,3.6 8.7,9.7 7.9,2.8 2.3,12.8 7,19.1 15.13,25.7 19,39.2 35.5,38.5 34.9,42.8 29.1,52.7 8.4,48 11.9,36.3 13,30.7 9.9,32.7 7.2,31.3 14.9,28.9 17.8,28.7 19.5,28.9 22.1,26.3 26.9,12.7 29.2,10.5 33.1,7.3 33,12.7 38.1,10
I2C1_SCL  (via drill 0.3)
  Top 0.254: U$1.P$5 17.6,52.17 17.6,53.41 17.2,54.05 v16.4,55.6 16.3,57.2 11.8,57.2 9,54.4 R1.2 | v17.32,47.86 17.5,47.5 17.8,46.9 18,46.7 U8.95
  Bottom 0.254: v16.4,55.6 16.3,53.5 16.3,47.9 16.8,47.9 v17.32,47.86
I2C1_SDA  (via drill 0.3, 0.33)
  Top 0.254: U8.96 17.5,46.6 v16.99,47.03 | v13.7,48.5 R2.2 | U$1.P$3 16.65,53.2 15.32,53.2 v14.48,52.76
  Bottom 0.254: v16.99,47.03 16.8,47.1 16.5,46.8 16.5,41.7 16,41.2 14.3,41.2 13.8,41.7 R2.2 | R2.2 13.9,48.55 v13.7,48.5 | v14.48,52.76 14.49,48.62 R2.2
LED_B  (via drill 0.3)
  Top 0.254: U8.16 26.6,36.7 27,36.2 v27.6,36.2 | v37.9,48.3 38.2,48.3 v37.9,48.3 | v37.9,48.3 R6.2
  Bottom 0.254: v27.6,36.2 30.3,34.2 34.5,34.2 37.6,37.3 37.6,43.1 37,43.7 37,46.8 37.9,47.3 v37.9,48.3
LED_G  (via drill 0.3)
  Top 0.254: U8.17 26.2,36.2 27.3,35.2 v27.5,35.2 | v38.1,45.7 38.05,45.55 R7.2
  Bottom 0.254: v27.5,35.2 29.9,33.7 35,33.7 37.75,36.45 38.1,36.8 v38.1,45.7
LED_R  (via drill 0.3)
  Top 0.254: U8.15 23.9,37.2 26,37.2 26.5,37.3 v27.4,37.3 | v37.9,51.5 37.85,51.45 R5.2
  Bottom 0.254: v27.4,37.3 27.8,36.9 28.1,36.9 30.3,35 34.2,34.9 37,37.6 37,42.6 36.4,43.2 36.4,46 36.4,47.8 36.9,48.3 36.9,49.9 37.2,50.2 v37.9,51.5
N$1
  Top 0.254: U8.13 12.1,38.2 11.5,38.8 10.9,38.8 10.4,39.3 6.4,39.3 4.4,41.3 Q1.P$2 4.4,41.35 C40.2
N$3
  Top 0.406: R8.1 13.56,17.09 IC1.7 13.5,15.73 13.5,14.1 13.8,13.8 15.9,13.8 16.11,14.01 IC1.5 21.9,15.8 25.6,12.1 25.6,10.21 J2.6
N$4
  Top 0.254: U8.12 12.7,38.7 12,39.4 11.1,39.4 9.1,41.4 7.5,41.4 7.6,41.3 Q1.P$1 8.05,42.75 C41.2
N$10  (via drill 0.3)
  Top 0.406: R9.1 14.84,18.21 14.84,17.3 | 14.84,17.3 14.84,16.73 | 14.84,16.73 IC1.6 | J2.5 20.82,14.6 v18.7,14.6 | v14.9,16.7 14.84,16.73 | 14.84,16.73 14.84,17.3
  Bottom 0.406: v18.7,14.6 15.1,16.6 v14.9,16.7
N$11
  Top 0.406: J2.2 20.05,9.7 17.4,9.7 16.5,10.6 IC1.4
N$12
  Top 0.254: U8.21 U8.22
  Top 0.305: U8.22 13.58,33.9 11.4,33.9 11.3,33.8 U3.1 | C5.1 12.9,28 12.5,28 12,28.5 U3.1 | U3.1 10.3,29.5 C4.1
N$13
  Top 0.254: U$1.P$10 20.2,52.07 20.2,51 | 20.2,51 20.2,50.4 20.8,49.8 C18.1 | U$1.P$4 17.1,52.09 | 17.1,52.09 17.1,51.1 17.2,51 20.2,51 | 17.1,52.09 17.11,53.31 16.86,53.68 14.41,53.69 14.12,53.41 10.58,53.38 10.3,52.8 U6.1
N$14
  Top 0.254: U$2.RED 34.5,51.6 R5.1
N$15
  Top 0.406: U$4.VBUS 27.2,22.4 26.7,21.9 U7.1
N$16
  Top 0.254: U$2.BLU 35.9,48.3 R6.1
N$17  (via drill 0.3)
  Top 0.254: U$1.P$11 20.7,52.07 20.7,51.1 v20.9,50.8 | v13.7,50.4 13.5,50.2 C15.1
  Bottom 0.254: v20.9,50.8 21,54.2 21,55.8 19.3,57.5 15.7,57.5 13.7,55.5 v13.7,50.4
N$18
  Top 0.254: U$2.GRN 34.4,45.7 R7.1
NRST
  Top 0.254: U8.14 11.9,37.7 10.9,36.7 R4.1
RAW  (via drill 0.3)
  Top 0.406: D1.1 30.5,16.75 v30.5,17.8 | 23.8,4.3 v24.3,3.8 24.2,3.8 | C10.1 23.1,4.92 | 22.8,7 23.1,6.7 C16.1 | R10.2 11.8,4.25 | 9.8,4.2 9.85,4.25 | R9.2 R8.2 11.15,21.2 9.7,21.2 9.4,20.9 9.4,11.7 10.95,10.15 10.95,9.25
  Top 0.61: 23.8,4.3 C10.1 | 23.1,4.92 C16.1 | J2.4 22.8,9.12 22.8,7 | 24.2,3.8 23.1,2.7 14.75,2.7 R11.2 11.8,4.25 9.85,4.25 | IC1.1 10.95,9.25 9.8,8.11 9.8,4.2
  Bottom 0.61: v30.5,17.8 31.2,17.1 31.2,7.7 31.2,4.9 30.1,3.8 v24.3,3.8
RXD  (via drill 0.3)
  Top 0.254: U8.48 26.5,29.3 26.2,29 v23.2,29 | v14.8,12.5 14.84,12.46 IC1.3
  Top 0.406: R11.1 13.2,7.7 14.84,9.34 IC1.3
  Bottom 0.254: v23.2,29 21,26.8 21,14.9 18.9,13.4 18,12.5 v14.8,12.5
SD_CD  (1 unrouted)
SDIO_CLK  (1 unrouted)
SDIO_CMD  (1 unrouted)
SDIO_D0  (2 unrouted)
SDIO_D1  (2 unrouted)
SDIO_D2  (1 unrouted)
SDIO_D3  (1 unrouted)
TXD  (via drill 0.3)
  Top 0.254: U8.47 26,29.5 v22.2,29.5 | v13.6,13.1 13.56,13.06 IC1.2
  Top 0.406: R10.1 11.3,7 13.56,9.27 IC1.2
  Bottom 0.254: v22.2,29.5 20.5,27.8 20.5,15.1 18.2,13.5 v13.6,13.1
VBUS  (via drill 0.3)
  Top 0.254: U8.68 v30.3,40.7 | v26.6,20.2 26.7,20.1
  Top 0.406: U7.2 26.7,20.2 26.7,20.1 26.7,19.5 | 28.55,16.95 D1.2
  Top 0.61: 28.55,16.95 26.7,18.8 26.7,19.5 26.7,20.1
  Bottom 0.254: v30.3,40.7 26.8,40.7 26.6,40.5 v26.6,20.2
VCAP1
  Top 0.254: U8.49 27,28.7 26.1,27.8 C49.1
VCAP2
  Top 0.254: C48.1 31.8,40.3 30.7,41.4 30.7,42.7 30.2,43.2 U8.73
VCC  (via drill 0.3)  (7 unrouted)
  Top 0.254: R2.1 14.63,45.92 U8.100 | U8.6 13.2,41.7 12.9,41.7 11.5,43.1 C9.1 | R4.2 7.3,36.65 C14.1 8.4,35.2 U8.19 | C19.1 30.2,45.18 U8.75 33,44.2 C12.2 | U$2.GND 31.96,50.36 31.6,50.3 31.6,46.7 31.3,46.4 | U8.28 16.5,30.4 16.5,32.2 16.1,32.6 v16,32.6
  Top 0.305: 15.9,35.2 U8.19 v16.7,35.2 | 15.3,41.2 14.8,41.7 13.2,41.7 | U8.11 v16.7,39.2
  Top 0.406: 11.25,46.75 10.4,47.6 10.4,50.7 U6.2 9.7,50.2 C7.1 6.85,50.85 R1.1 | 11.25,46.75 R2.1 | 11.5,43.1 11.25,43.35 11.25,46.75 | 19.1,25.4 C8.1 | U8.50 27.6,30.38 27.82,30.6 | 22.73,24.3 22.59,23.6 | C20.1 32,30.7 | 33.4,34.9 C6.1 33.5,35.4 | v31.6,45.7 31.3,46 | v9.9,27.1 10.1,26.9 U3.2 | 15.9,35.2 16,35.1 | v16.2,40.8 15.3,41.2
  Top 0.61: U4.1 U4.2 | C1.1 29.1,46.4 C19.1 31.3,46.4 31.3,46 | 22.59,23.6 22.62,25.37 19.1,25.4 | 27.6,30.38 27.6,27.7 22.73,24.3 | 27.82,30.6 C20.1 | 32,30.7 32,33.5 33.4,34.9 | 33.5,35.4 v33.5,37 | C8.1 v19.1,27.1 | 16,35.1 v16,32.6
  Bottom 0.305: v16.7,39.2 16.9,39 16.8,39
  Bottom 0.406: v16,32.6 16.2,32.4 | v16.7,35.2 16.8,35.3 | 16.8,39 16.8,39.2
  Bottom 0.61: v33.5,37 31.6,38.9 v31.6,45.7 | v19.1,27.1 16.2,27.1 | 16.2,27.1 v9.9,27.1 | 16.2,32.4 16.2,27.1 | 16.8,35.3 16.8,39 | 16.8,39.2 16.2,39.8 v16.2,40.8
VIN
  Top 0.406: D1.3 29.6,14.4 | 32,14.8 C3.1 | 24.1,17.1 U4.5 | U4.8 | 25.5,17.1 24.95,16.55 24.65,16.55
  Top 0.61: 29.6,14.4 31.6,14.4 32,14.8 | D1.3 26.7,14.5 24.65,16.55 24.1,17.1 | U4.8 25.1,21.3 25.5,20.9 25.5,17.1

### Text on the board
tDocu: mindsensors.com | NXTcam V3
bDocu: mindsensors.com | NXTcam
_tNames: X1 | PGM | BUSY
_bNames: TP14